# Altium schematic sheet Lid Sensor.SchDoc
size B
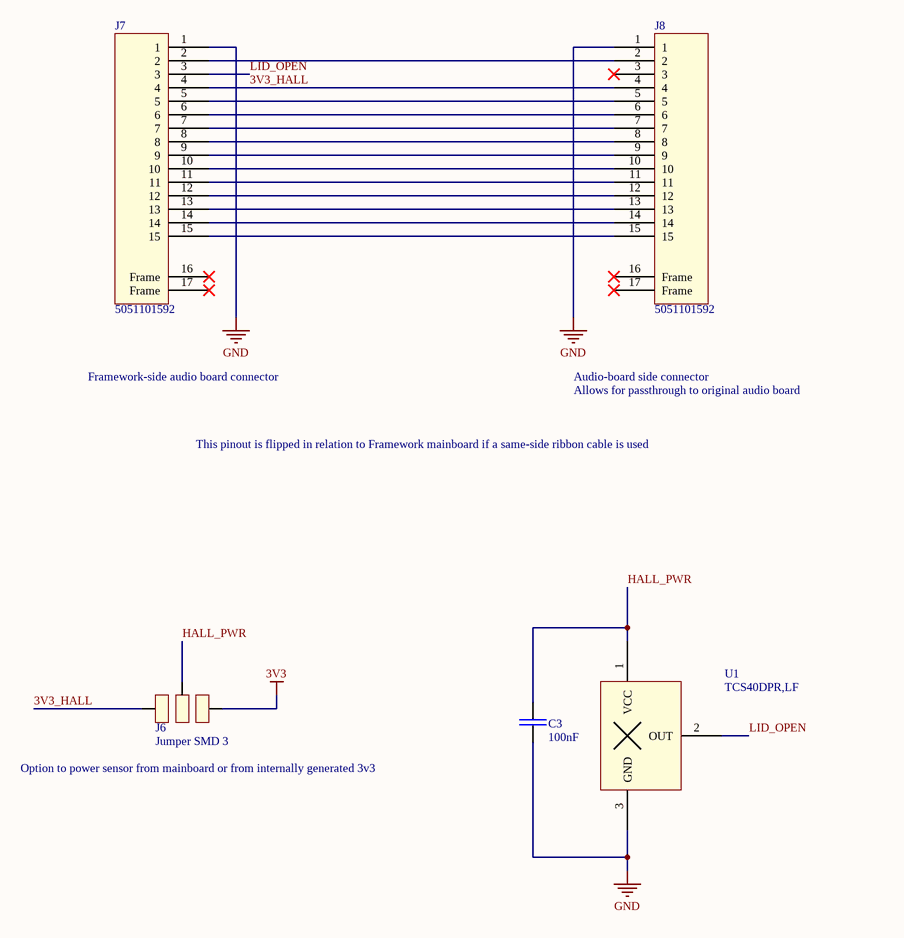
[diagram p0: Lid Sensor.SchDoc]

## Parts
C3  100nF  [CAP_SM0603_YAGEOCC2_N]
J6  Jumper SMD 3  [Jumper SMD 3]
J7  5051101592  [5051101592]
J8  5051101592  [5051101592]
U1  TCS40DPR,LF  [TCS40DPR,LF - SOT23127P600-8N]

## Nets
3V3: J6.1
GND: C3.1 J7.1 J8.1 U1.3(GND)
3V3_HALL: J6.3 J7.4 J8.4
HALL_PWR: C3.2 J6.2 U1.1(VCC)
LID_OPEN: J7.3 U1.2(OUT)
NetJ7_2: J7.2 J8.2
NetJ7_5: J7.5 J8.5
NetJ7_6: J7.6 J8.6
NetJ7_7: J7.7 J8.7
NetJ7_8: J7.8 J8.8
NetJ7_9: J7.9 J8.9
NetJ7_10: J7.10 J8.10
NetJ7_11: J7.11 J8.11
NetJ7_12: J7.12 J8.12
NetJ7_13: J7.13 J8.13
NetJ7_14: J7.14 J8.14
NetJ7_15: J7.15 J8.15

Not connected (* = marked no-connect by the designer): J7 16(Frame)* 17(Frame)*; J8 3* 16(Frame)* 17(Frame)*

## Notes on the sheet
- Framework-side audio board connector
- Audio-board side connector
- Allows for passthrough to original audio board
- This pinout is flipped in relation to Framework mainboard if a same-side ribbon cable is used
- Option to power sensor from mainboard or from internally generated 3v3

## Library data of the parts
C3 = CC0603KRX7R9BB104: CAP 100nF SM0603 X7R 50V YAGEO CC2; Tolerance (%): 10; Voltage Rating (Volts): 50; Value: 100nF; Category: Capacitor; Manufacturer: Yageo; Manufacturer Part Number: CC0603KRX7R9BB104; Package: 0603; Supplier Part Number 1: 1362556; Supplier 1: Farnell; ComponentLink1URL: http://www.yageo.com; ComponentLink1Description: Manufacturer Website; Supplier 2: Digi-Key; Supplier Part Number 2: 311-1344-1-ND